# Altium schematic sheet [03]GSM_GPRS_GPS.SchDoc
size A4
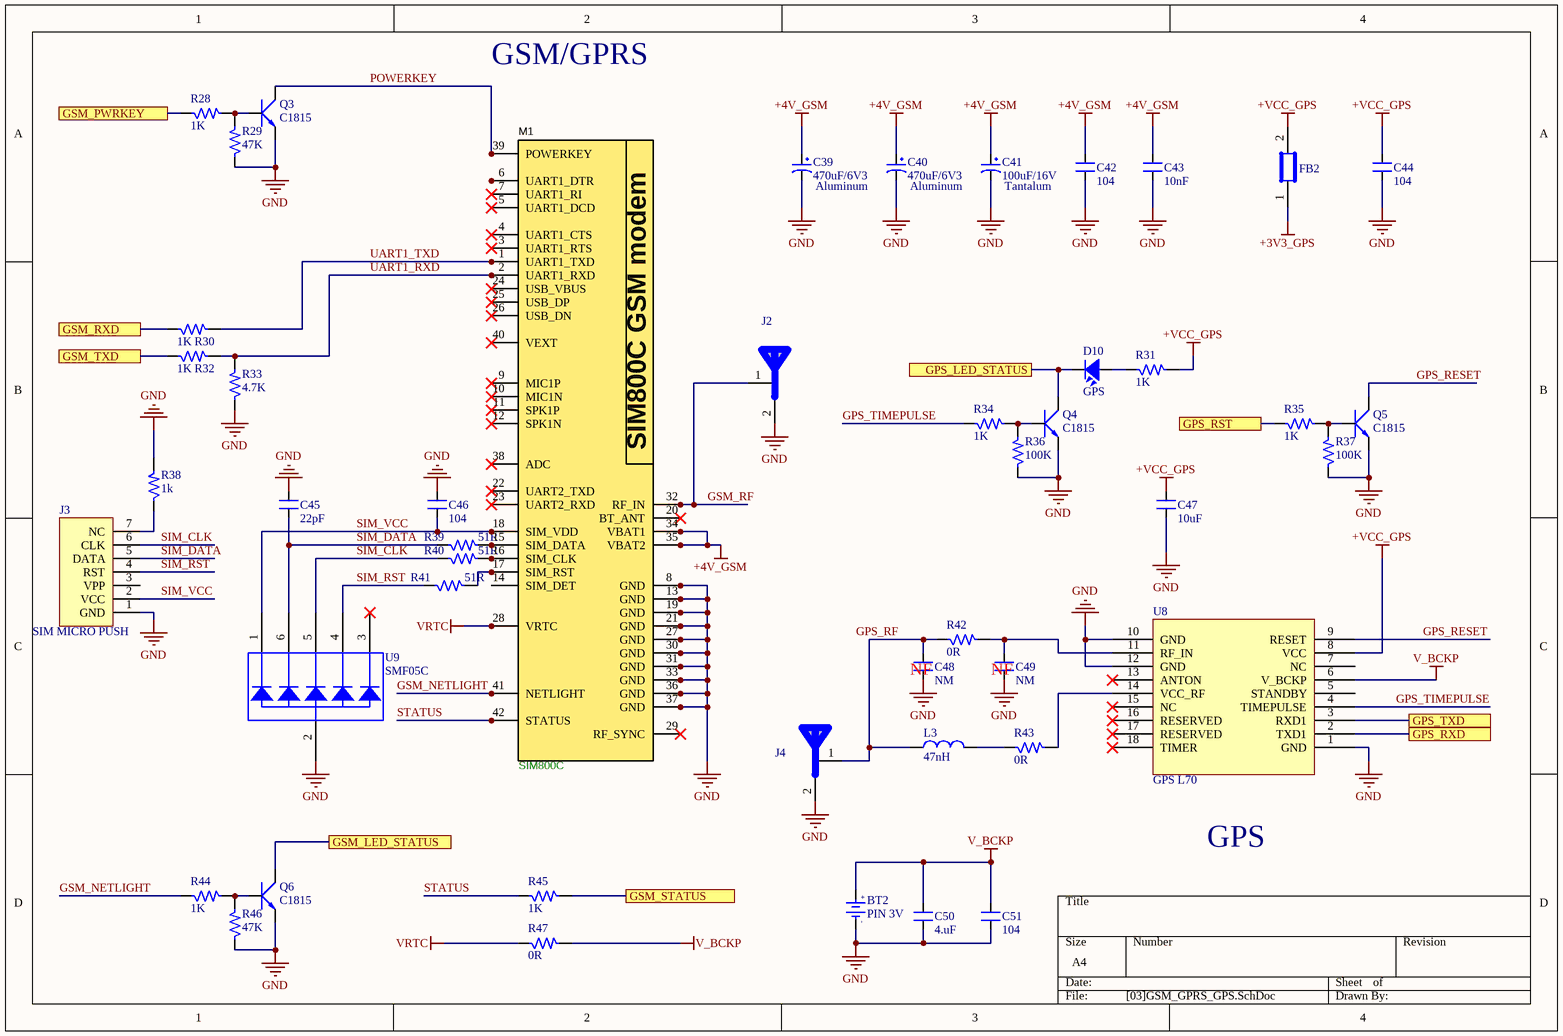
[diagram p0: [03]GSM_GPRS_GPS.SchDoc]

## Parts
BT2  PIN 3V  [CR1220 SMD]
C39  470uF/6V3  [C_Alu_6.3x7.7]
C40  470uF/6V3  [C_Alu_6.3x7.7]
C41  100uF/16V  [C_7343_40]
C42  104  [CAP_0805]
C43  10nF  [CAP_0805]
C44  104  [CAP_0805]
C45  22pF  [C0603 SMT]
C46  104  [C0603 SMT]
C47  10uF  [CAP_0805]
C48  NM  [C0603 SMT]
C49  NM  [C0603 SMT]
C50  4.uF  [SM-1210]
C51  104  [CAP_0805]
D10  GPS  [LED-0805-Red]
FB2  BLM21PG600SN1D  [R0805]  (value not drawn)
J2  GPS_ANTENNA  [Antenna-MCX5.08-H5]  (value not drawn)
J3  SIM MICRO PUSH  [MICROSIM_PUSH]
J4  GPS_ANTENNA  [Antenna-MCX5.08-H5]  (value not drawn)
L3  47nH  [RES-SMD-0805]
M1  SIM800C  [SIM800C]
Q3  C1815  [SOT23B]
Q4  C1815  [SOT23B]
Q5  C1815  [SOT23B]
Q6  C1815  [SOT23B]
R28  1K  [R0603 -SMT]
R29  47K  [R0603 -SMT]
R30  1K  [R0603 -SMT]
R31  1K  [RES-SMD-0805]
R32  1K  [R0603 -SMT]
R33  4.7K  [R0603 -SMT]
R34  1K  [RES-SMD-0805]
R35  1K  [RES-SMD-0805]
R36  100K  [RES-SMD-0805]
R37  100K  [RES-SMD-0805]
R38  1k  [RES-SMD-0805]
R39  51R  [R0603 -SMT]
R40  51R  [R0603 -SMT]
R41  51R  [R0603 -SMT]
R42  0R  [R0603 -SMT]
R43  0R  [R0603 -SMT]
R44  1K  [R0603 -SMT]
R45  1K  [R0603 -SMT]
R46  47K  [R0603 -SMT]
R47  0R  [RES-SMD-0805]
U8  GPS L70  [GPS L70]
U9  SMF05C  [SOT_363_6]

## Ports
GPS_LED_STATUS, GPS_RST, GPS_RXD, GPS_TXD, GSM_LED_STATUS, GSM_PWRKEY, GSM_RXD, GSM_STATUS, GSM_TXD

## Nets
+3V3_GPS: FB2.1
+4V_GSM: C39.1 C40.1 C41.1 C42.1 C43.1 M1.34(VBAT1) M1.35(VBAT2)
+VCC_GPS: C44.2 C47.2 FB2.2 R31.2 U8.8(VCC)
GND: BT2.2(GND) C39.2 C40.2 C41.2 C42.2 C43.2 C44.1 C45.2 C46.2 C47.1 C48.1 C49.1 C50.1 C51.1 J2.2(GND) J3.1(GND) J4.2(GND) M1.8(GND) M1.13(GND) M1.19(GND) M1.21(GND) M1.27(GND) M1.30(GND) M1.31(GND) M1.33(GND) M1.36(GND) M1.37(GND) Q3.1(E) Q4.1(E) Q5.1(E) Q6.1(E) R29.1 R33.1 R36.1 R37.1 R38.2 R46.1 U8.1(GND) U8.10(GND) U8.12(GND) U9.2(A)
V_BCKP: BT2.1(+3V) C50.2 C51.2 R47.2 U8.6(V_BCKP)
VRTC: M1.28(VRTC) R47.1
GPS_LED_STATUS: D10.2 Q4.2(C) ; port GPS_LED_STATUS
GPS_RESET: Q5.2(C) U8.9(RESET)
GPS_RST: R35.1 ; port GPS_RST
GPS_RXD: U8.2(TXD1) ; port GPS_RXD
GPS_TIMEPULSE: R34.1 U8.4(TIMEPULSE)
GPS_TXD: U8.3(RXD1) ; port GPS_TXD
GSM_LED_STATUS: Q6.2(C) ; port GSM_LED_STATUS
GSM_NETLIGHT: M1.41(NETLIGHT) R44.1
GSM_PWRKEY: R28.1 ; port GSM_PWRKEY
GSM_RF: J2.1(GND) M1.32(RF_IN)
GSM_RXD: R30.1 ; port GSM_RXD
GSM_STATUS: R45.2 ; port GSM_STATUS
GSM_TXD: R32.1 ; port GSM_TXD
POWERKEY: M1.39(POWERKEY) Q3.2(C)
SIM_CLK: J3.6(CLK) R40.1 U9.5(K4)
SIM_DATA: C45.1 J3.5(DATA) R39.1 U9.6(K5)
SIM_RST: J3.4(RST) R41.1 U9.4(K3)
SIM_VCC: C46.1 J3.2(VCC) M1.18(SIM_VDD) U9.1(K1)
STATUS: M1.42(STATUS) R45.1
UART1_RXD: M1.2(UART1_RXD) R32.2 R33.2
UART1_TXD: M1.1(UART1_TXD) R30.2
NetC48_2: C48.2 J4.1(GND) L3.1 R42.1
NetC49_2: C49.2 R42.2 U8.11(RF_IN)
NetD10_1: D10.1 R31.1
NetJ3_7: J3.7(NC) R38.1
NetL3_2: L3.2 R43.1
NetM1_15: M1.15(SIM_DATA) R39.2
NetM1_16: M1.16(SIM_CLK) R40.2
NetM1_17: M1.17(SIM_RST) R41.2
NetQ3_3: Q3.3(B) R28.2 R29.2
NetQ4_3: Q4.3(B) R34.2 R36.2
NetQ5_3: Q5.3(B) R35.2 R37.2
NetQ6_3: Q6.3(B) R44.2 R46.2
NetR43_2: R43.2 U8.14(VCC_RF)

Not connected (* = marked no-connect by the designer): J3 3(VPP); M1 3(UART1_RTS)* 4(UART1_CTS)* 5(UART1_DCD)* 6(UART1_DTR) 7(UART1_RI)* 9(MIC1P)* 10(MIC1N)* 11(SPK1P)* 12(SPK1N)* 14(SIM_DET) 20(BT_ANT)* 22(UART2_TXD)* 23(UART2_RXD)* 24(USB_VBUS)* 25(USB_DP)* 26(USB_DN)* 29(RF_SYNC)* 38(ADC)* 40(VEXT)*; U8 5(STANDBY) 7(NC) 13(ANTON)* 15(NC)* 16(RESERVED)* 17(RESERVED)* 18(TIMER)*; U9 3(K2)*

## Notes on the sheet
- GSM/GPRS
- (near C39) Aluminum
- (near C40) Aluminum
- (near C41) Tantalum
- (near C48) NF
- (near C49) NF
- GPS
- Labels drawn without touching a wire or pin: GPS_RF
- (in symbol PIN 3V) +; -
- (in symbol SIM800C) SIM800C GSM modem

## Library data of the parts
BT2 = PIN 3V: Battery 3VDC; Value: PIN 3V
C39 C40 = C-Alu-Tantalum: Cap Aluminum; Value: 10uF/50V; Description 1: 10 => 220uF/6,3V/10V - 10uF => 100uF/16V; Description 2: 0,1uF => 33uF/50V - 10uF => 22uF/63V; Description 3: 0,47uF => 10uF/100V
C41 = C-Alu-Tantalum: Cap Tantalum 7343; Value: 10uF/50V; Description 1: 10 => 220uF/6,3V/10V - 10uF => 100uF/16V; Description 2: 0,1uF => 33uF/50V - 10uF => 22uF/63V; Description 3: 0,47uF => 10uF/100V
C42-C51 = CM: Cap SMD; Value: 103
D10 = LED: LED Single colour Green and Red; Value: LED 3 ly Single Colour
FB2 = Ferrite Bead
J2 J4 = ANTEN
L3 = L1: Inductor; Value: 150 mH
Q3-Q6 = C1815: NPN 600mW, ECB; Value: C1815
R28 R30-R32 R34 R35 R38 R44 R45 = RM: Resistor SMD; Value: 1K
R29 R33 R36 R37 R39-R43 R46 R47 = RM: Resistor SMD; Value: 1K
U9 = SMF05C: ESD Protection